# EAGLE design 5V_AC-DC_adi (EAGLE 9.6.2)
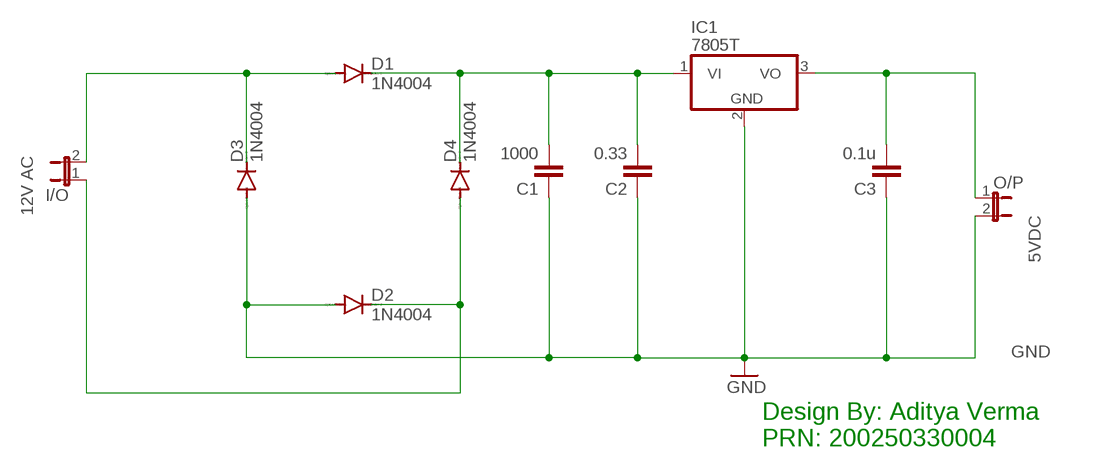
[diagram p0: schematic, sheet 1]

## Parts
C1  1000  C2,5-3  [C2.5-3]
C2  0.33  C2,5-3  [C2.5-3]
C3  0.1u  C2,5-3  [C2.5-3]
D1  1N4004  [DO41-10]
D2  1N4004  [DO41-10]
D3  1N4004  [DO41-10]
D4  1N4004  [DO41-10]
I/O  JP1E  [JP1]
IC1  7805T  [TO220H]
O/P  JP1E  [JP1]

## Nets
GND: C1.1 C2.1 C3.1 D2.A D3.A IC1.2(GND) O/P.2
N$1: D1.A D3.C I/O.2
N$3: D2.C D4.A I/O.1
N$4: C1.2 C2.2 D1.C D4.C IC1.1(VI)
N$5: C3.2 IC1.3(VO) O/P.1

## Notes on the sheet
- Design By: Aditya Verma
  PRN: 200250330004

## Library data of the parts
C1-C3 = capacitor-wima:C: CAPACITOR naming: grid - package width
D1-D4 = diode:1N4004: DIODE general purpose rectifier, 1 A
I/O O/P = jumper:JP1E: JUMPER
IC1 = linear:78*: Positive VOLTAGE REGULATOR Source: http://cache.national.com/ds/LM/LM78L05.pdf http://www.fairchildsemi.com/ds/LM/LM7805.pdf

## Board
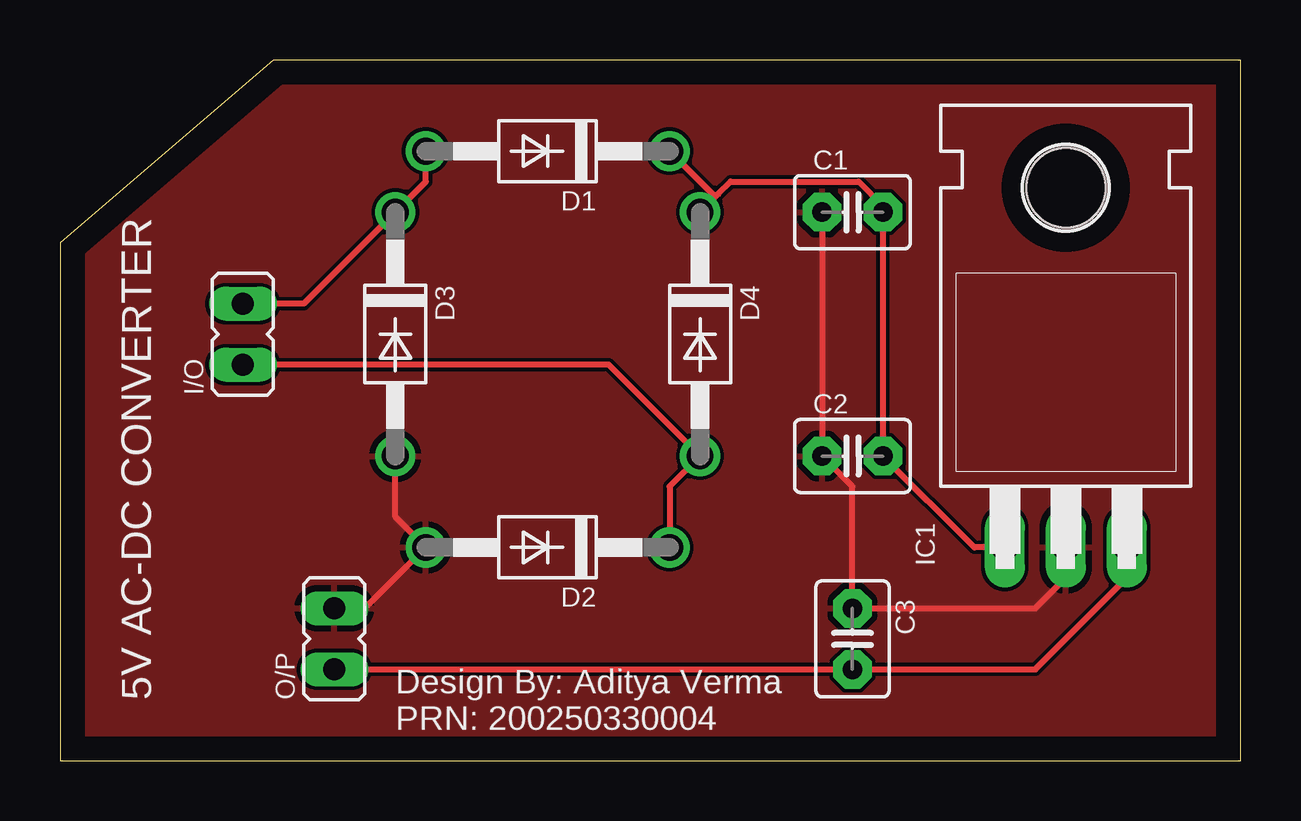
[diagram p1: board, top side]
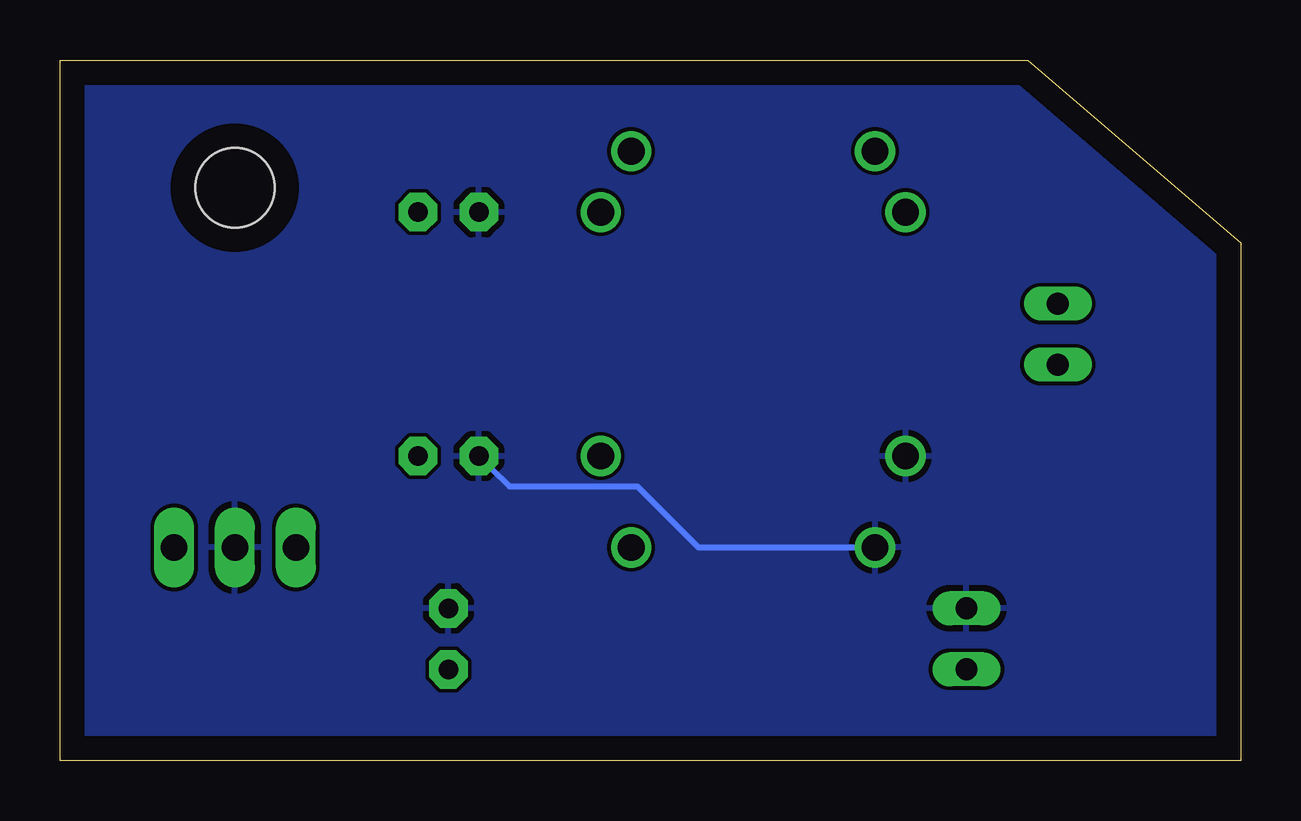
[diagram p2: board, bottom side, seen from below]

Size 49.2 x 29.2 mm. Coordinates in mm from the lower left corner, seen from the top.
Outline: 0,0 49.2,0 49.2,29.2 8.88,29.2 0,21.59 0,0
Copper layers (1*16): Top 0.035mm / dielectric 1.5mm / Bottom 0.035mm
Design rules "default": minimum track width 6mil, minimum drill 0.35mm, track to track 6mil, track to pad 6mil, pad to pad 6mil, via to via 6mil, smd to smd 6mil, copper to edge 40mil, drill to drill 6mil, minimum pad ring 10mil, minimum via ring 8mil, stop-mask expansion 4mil, vias tented up to drill 0mil, thermal gap 10mil

### Footprints (pad centres in the part's own frame; a part is rotated, then mirrored left to right if it is on the bottom)
C2.5-3 = drill 0.813 pad 1.6 octagon: 1 -1.27,0; 2 1.27,0
DO41-10 = drill 1.118: A 5.08,0; C -5.08,0
JP1 = drill 0.914 long: 1 0,-1.27; 2 0,1.27
TO220H = drill 1.118 long: 1 -2.54,-10.16; 2 0,-10.16; 3 2.54,-10.16 | hole 3.302: 0,4.826

### Placement (x,y rotation side)
C1  33.02,22.86 0 top
C2  33.02,12.7 0 top
C3  33.02,5.08 270 top
D1  20.32,25.4 180 top
D2  20.32,8.89 180 top
D3  13.97,17.78 270 top
D4  26.67,17.78 270 top
I/O  7.62,17.78 0 top
IC1  41.91,19.05 0 top
O/P  11.43,5.08 0 top

### Tracks (layer width: path | path; a pad name or v marks a point on that pad's centre or on a via)
GND
  Top 0.152: 12.7,6.35 O/P.2
  Top 0.254: 12.7,6.35 D2.A 13.97,10.16 D3.A | C1.1 C2.1 33.02,11.43 C3.1 40.64,6.35 41.91,7.62 IC1.2
  Bottom 0.152: 31.24,12.19 C2.1
  Bottom 0.254: D2.A 22.61,8.89 25.15,11.43 30.48,11.43 31.24,12.19
  pour Bottom: -2.54,21.59 -2.54,-2.54 52.07,-2.54 52.07,31.75 7.62,31.75
  pour Top: -1.27,21.59 -1.27,-1.27 50.8,-1.27 50.8,30.48 7.62,30.48
N$1
  Top 0.254: I/O.2 10.16,19.05 D3.C 15.24,24.13 D1.A
N$3
  Top 0.254: I/O.1 22.86,16.51 D4.A 25.4,11.43 D2.C
N$4
  Top 0.152: 27.43,23.62 27.18,23.62
  Top 0.254: IC1.1 38.1,8.89 C2.2 C1.2 34.29,23.11 33.27,24.13 27.94,24.13 27.43,23.62 D4.C | 27.18,23.62 D1.C
N$5
  Top 0.254: O/P.1 C3.2 40.64,3.81 44.45,7.62 IC1.3

### Text on the board
tPlace: 5V AC-DC CONVERTER
tNames: Design By: Aditya Verma / PRN: 200250330004